# EAGLE design AstroHub (EAGLE 7.2.0)
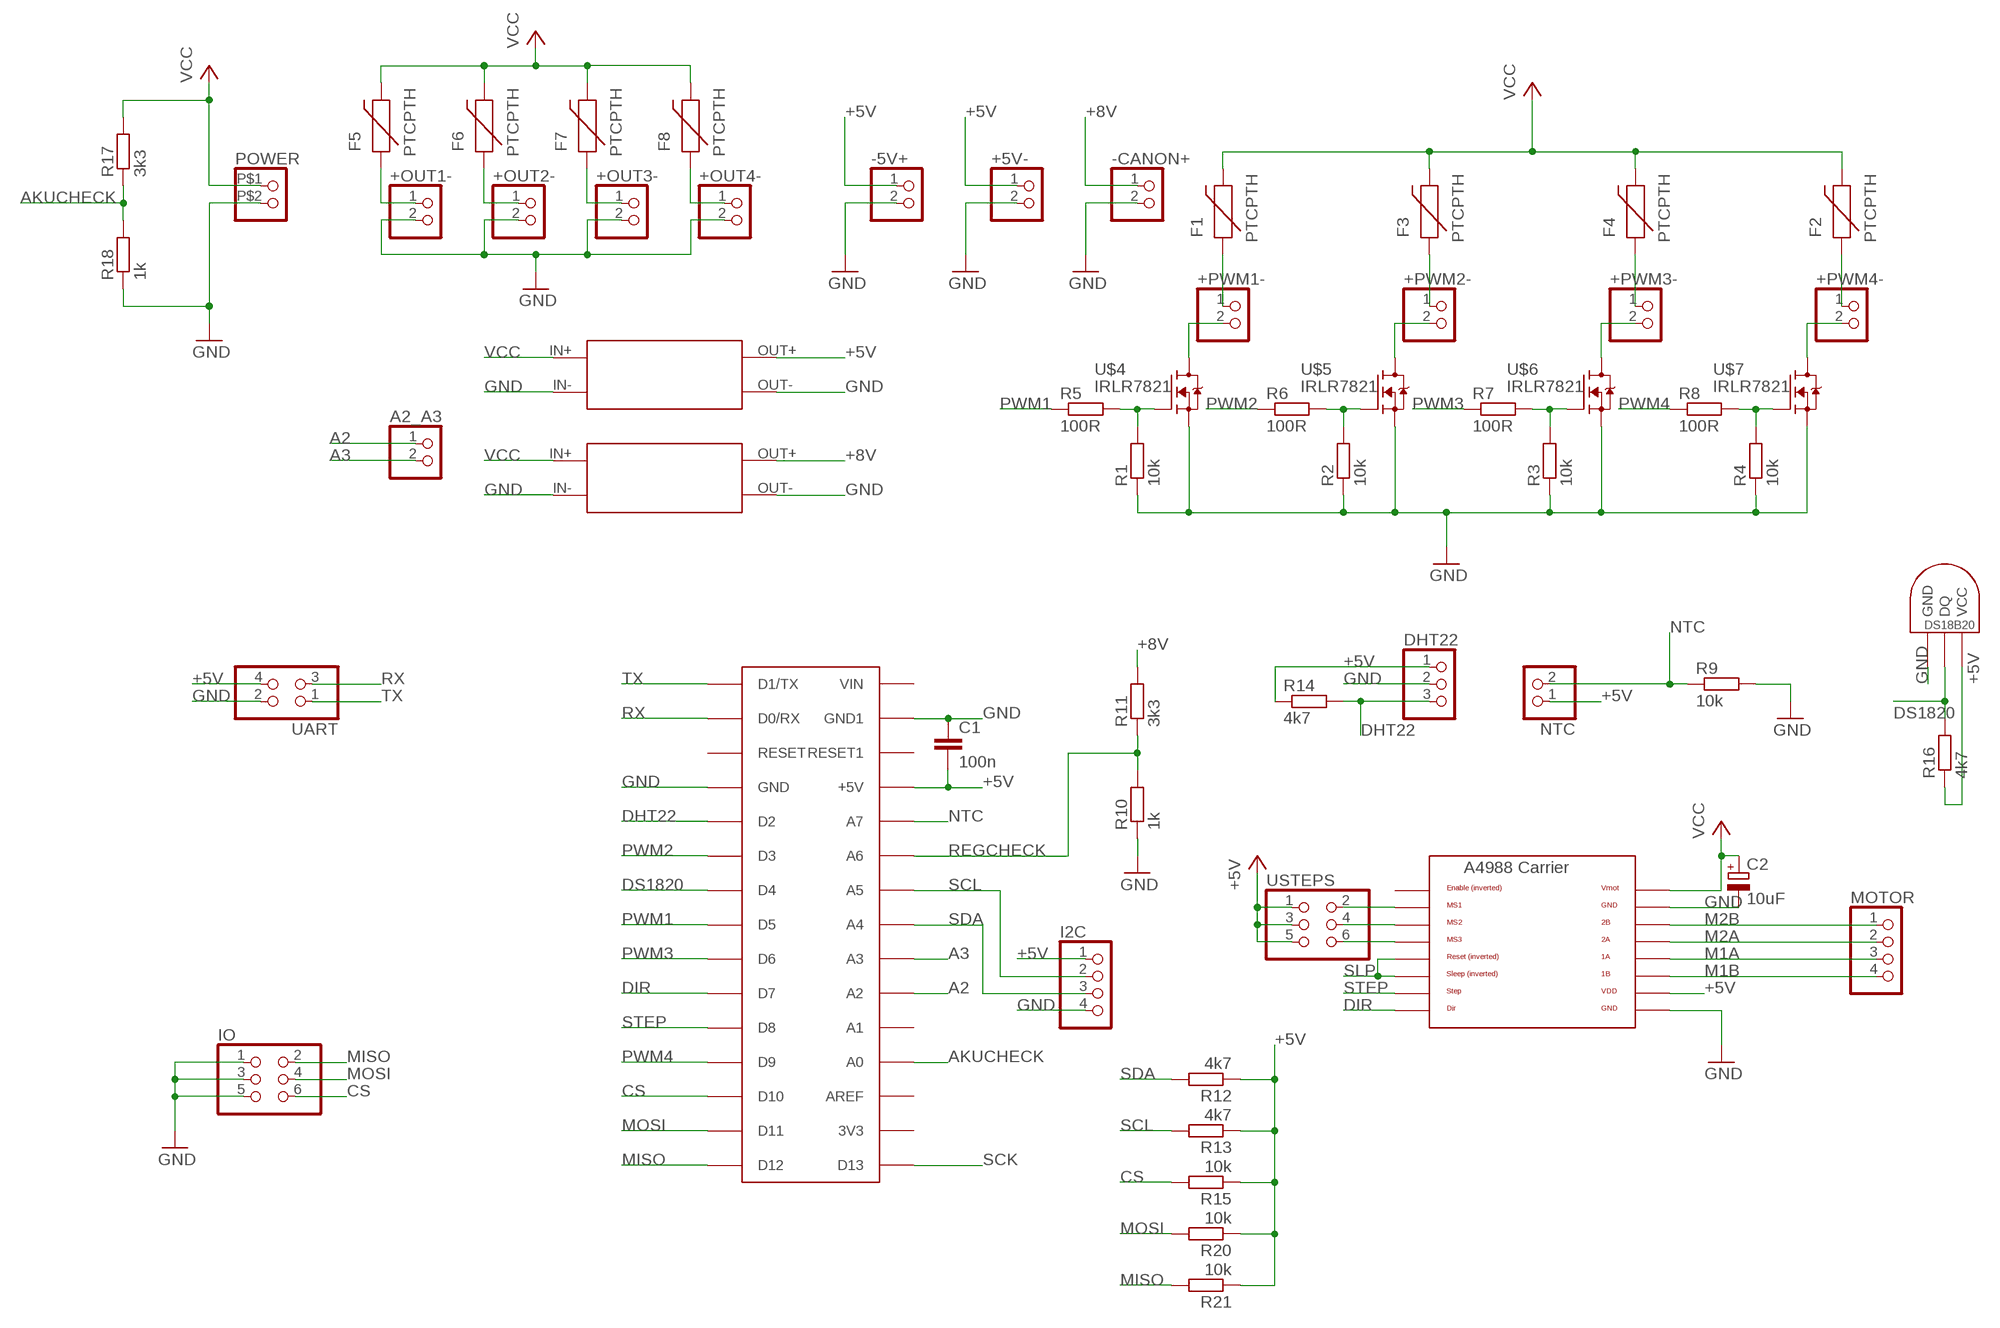
[diagram p0: schematic, sheet 1]

## Parts
+5V-  PINHD-1X2  [1X02]
+OUT1-  PINHD-1X2  [1X02]
+OUT2-  PINHD-1X2  [1X02]
+OUT3-  PINHD-1X2  [1X02]
+OUT4-  PINHD-1X2  [1X02]
+PWM1-  PINHD-1X2  [1X02]
+PWM2-  PINHD-1X2  [1X02]
+PWM3-  PINHD-1X2  [1X02]
+PWM4-  PINHD-1X2  [1X02]
-5V+  PINHD-1X2  [1X02]
-CANON+  PINHD-1X2  [1X02]
A2_A3  PINHD-1X2  [1X02]
C1  100n  C-EUC0603  [C0603]
C2  10uF  CPOL-EUSMCD  [SMC_D]
DHT22  PINHD-1X3  [1X03]
F1  PTCPTH  [PTC]
F2  PTCPTH  [PTC]
F3  PTCPTH  [PTC]
F4  PTCPTH  [PTC]
F5  PTCPTH  [PTC]
F6  PTCPTH  [PTC]
F7  PTCPTH  [PTC]
F8  PTCPTH  [PTC]
I2C  PINHD-1X4  [1X04]
IO  PINHD-2X3  [2X03]
MOTOR  PINHD-1X4  [1X04]
NTC  PINHD-1X2  [1X02]
POWER  PINHD-1X2BIG  [1X02BIG]
R1  10k  R-EU_R0603  [R0603]
R2  10k  R-EU_R0603  [R0603]
R3  10k  R-EU_R0603  [R0603]
R4  10k  R-EU_R0603  [R0603]
R5  100R  R-EU_R0603  [R0603]
R6  100R  R-EU_R0603  [R0603]
R7  100R  R-EU_R0603  [R0603]
R8  100R  R-EU_R0603  [R0603]
R9  10k  R-EU_R0603  [R0603]
R10  1k  R-EU_R0603  [R0603]
R11  3k3  R-EU_R0603  [R0603]
R12  4k7  R-EU_R0603  [R0603]
R13  4k7  R-EU_R0603  [R0603]
R14  4k7  R-EU_R0603  [R0603]
R15  10k  R-EU_R0603  [R0603]
R16  4k7  R-EU_R0603  [R0603]
R17  3k3  R-EU_R0603  [R0603]
R18  1k  R-EU_R0603  [R0603]
R20  10k  R-EU_R0603  [R0603]
R21  10k  R-EU_R0603  [R0603]
U$1  ARDUINONANO  [PDIP-32]
U$2  LM2596BOARD  [LM2596BOARD]
U$3  A4988BREAKOUT  [A4988BREAKOUT]
U$4  IRLR7821  [TO252]
U$5  IRLR7821  [TO252]
U$6  IRLR7821  [TO252]
U$7  IRLR7821  [TO252]
U$8  LM2596BOARD  [LM2596BOARD]
U$9  DS1820TO92  [DS1820]
UART  PINHD-2X2  [2X02]
USTEPS  PINHD-2X3  [2X03]

## Nets
+5V: +5V-.1 -5V+.1 C1.2 DHT22.1 I2C.1 NTC.1 R12.1 R13.1 R14.1 R15.1 R16.1 R20.1 R21.1 U$1.+5V U$2.OUT+ U$3.VDD U$9.VDD(VCC) UART.4 USTEPS.1 USTEPS.3 USTEPS.5
+8V: -CANON+.1 R11.2 U$8.OUT+
A2: A2_A3.1 U$1.A2
A3: A2_A3.2 U$1.A3
AKUCHECK: R17.1 R18.2 U$1.A0
CS: IO.6 R15.2 U$1.D10
DHT22: DHT22.3 R14.2 U$1.D2
DIR: U$1.D7 U$3.DIR
DS1820: R16.2 U$1.D4 U$9.DQ
GND: +5V-.2 +OUT1-.2 +OUT2-.2 +OUT3-.2 +OUT4-.2 -5V+.2 -CANON+.2 C1.1 C2.- DHT22.2 I2C.4 IO.1 IO.3 IO.5 POWER.P$2 R1.1 R2.1 R3.1 R4.1 R9.2 R10.1 R18.1 U$1.GND U$1.GND1 U$2.IN- U$2.OUT- U$3.GND U$3.GND@0(GND) U$4.2(S) U$5.2(S) U$6.2(S) U$7.2(S) U$8.IN- U$8.OUT- U$9.GND UART.2
M1A [VCC]: MOTOR.3 U$3.1A
M1B [VCC]: MOTOR.4 U$3.1B
M2A [VCC]: MOTOR.2 U$3.2A
M2B [VCC]: MOTOR.1 U$3.2B
MISO: IO.2 R21.2 U$1.D12
MOSI: IO.4 R20.2 U$1.D11
N$1: R4.2 R8.2 U$7.1(G)
N$2: R3.2 R7.2 U$6.1(G)
N$3: R2.2 R6.2 U$5.1(G)
N$4: R1.2 R5.2 U$4.1(G)
N$5: U$3.MS3 USTEPS.6
N$6: U$3.MS2 USTEPS.4
N$7: U$3.MS1 USTEPS.2
N$9 [VCC]: +PWM1-.1 F1.P$1
N$10 [VCC]: +PWM4-.1 F2.P$1
N$11 [VCC]: +PWM2-.1 F3.P$1
N$12 [VCC]: +PWM3-.1 F4.P$1
N$14 [VCC]: +OUT1-.1 F5.P$1
N$15 [VCC]: +OUT2-.1 F6.P$1
N$16 [VCC]: +OUT3-.1 F7.P$1
N$17 [VCC]: +OUT4-.1 F8.P$1
NTC: NTC.2 R9.1 U$1.A7
P1V [PWM]: +PWM1-.2 U$4.3(D)
P2V [PWM]: +PWM2-.2 U$5.3(D)
P3V [PWM]: +PWM3-.2 U$6.3(D)
P4V [PWM]: +PWM4-.2 U$7.3(D)
PWM1: R5.1 U$1.D5
PWM2: R6.1 U$1.D3
PWM3: R7.1 U$1.D6
PWM4: R8.1 U$1.D9
REGCHECK: R10.2 R11.1 U$1.A6
RX: U$1.D0/RX UART.3
SCK: U$1.D13
SCL: I2C.2 R13.2 U$1.A5
SDA: I2C.3 R12.2 U$1.A4
SLP: U$3.RST U$3.SLP(SLEEP)
STEP: U$1.D8 U$3.STEP
TX: U$1.D1/TX UART.1
VCC [VCC]: C2.+ F1.P$2 F2.P$2 F3.P$2 F4.P$2 F5.P$2 F6.P$2 F7.P$2 F8.P$2 POWER.P$1 R17.2 U$2.IN+ U$3.VMOT U$8.IN+
Unconnected: U$1.3V3 U$1.A1 U$1.AREF U$1.RESET U$1.RESET1 U$1.VIN U$3.EN

## Library data of the parts
+5V- +OUT1- +OUT2- +OUT3- +OUT4- +PWM1- +PWM2- +PWM3- +PWM4- -5V+ -CANON+ A2_A3 NTC POWER = pinhead:PINHD-1X2: PIN HEADER
C1 = resistor:C-EU: CAPACITOR, European symbol
C2 = resistor:CPOL-EU: POLARIZED CAPACITOR, European symbol
DHT22 = pinhead:PINHD-1X3: PIN HEADER
F1-F8 = SparkFun-PowerIC:PTC: Resettable Fuse PTC Resettable Fuse. Spark Fun Electronics SKU : COM-08357
I2C MOTOR = pinhead:PINHD-1X4: PIN HEADER
IO USTEPS = pinhead:PINHD-2X3: PIN HEADER
R1-R18 R20 R21 = resistor:R-EU_: RESISTOR, European symbol
U$1 = jet-lib:ARDUINONANO
U$2 U$8 = dc-dc-converter:LM2596BOARD
U$3 = reprap2:A4988BREAKOUT
U$4-U$7 = transistor-fet:IRLR7821
U$9 = Ava:DS1820: DS18B20 Programmable Resolution 1-Wire Digital Thermometer Description The DS18B20 digital thermometer provides 9-bit to 12-bit Celsius temperature measurements and has an alarm function with nonvolatile user-programmable upper and lower trigger points. The DS18B20 communicates over a 1-Wire® bus that by definition requires only one data line (and ground) for communication with a central microprocessor. It has an operating temperature range of -55°C to +125°C and is accurate to ±0.5°C over the range of -10°C to +85°C. In addition, the DS18B20 can derive power directly from the data line ("parasite power"), eliminating the need for an external power supply. Each DS18B20 has a unique 64-bit serial code, which allows multiple DS18B20s to function on the same 1-Wire bus. Thus, it is simple to use one microprocessor to control many DS18B20s distributed over a large area. Applications that can benefit from this feature include HVAC environmental controls, temperature monitoring systems inside buildings, equipment, or machinery, and process monitoring and control systems.
UART = pinhead:PINHD-2X2: PIN HEADER

## Net classes
0 rest: clearance 0.203 mm
1 VCC: clearance 0.508 mm
2 PWM: clearance 0.508 mm

## Board
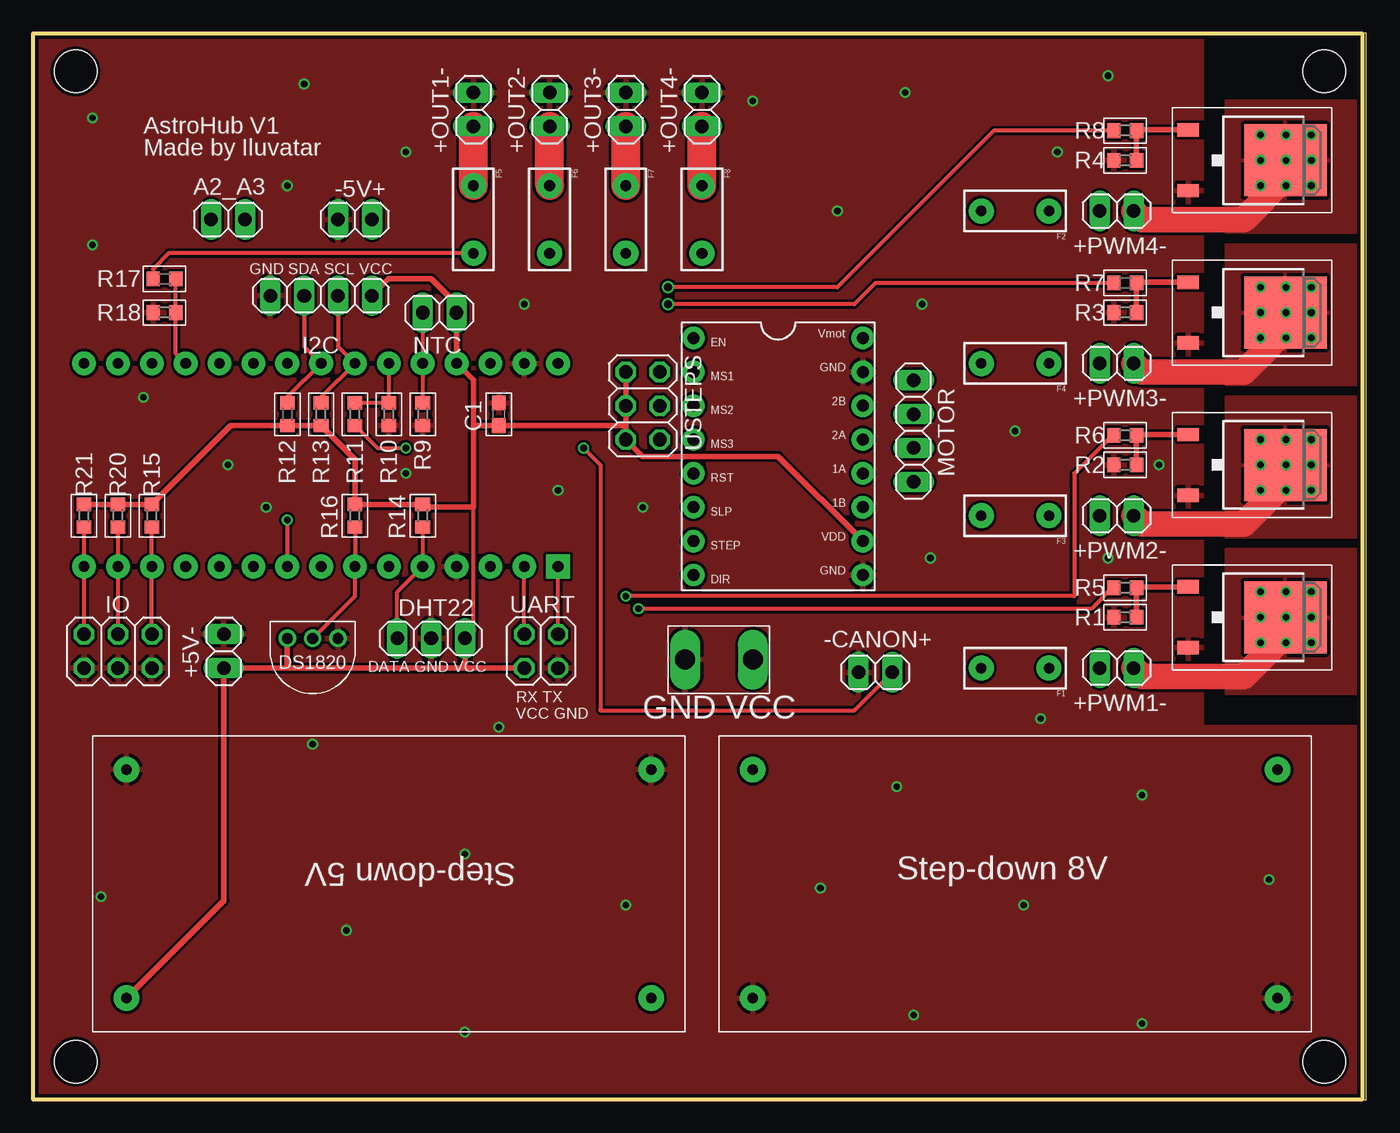
[diagram p1: board, top side]
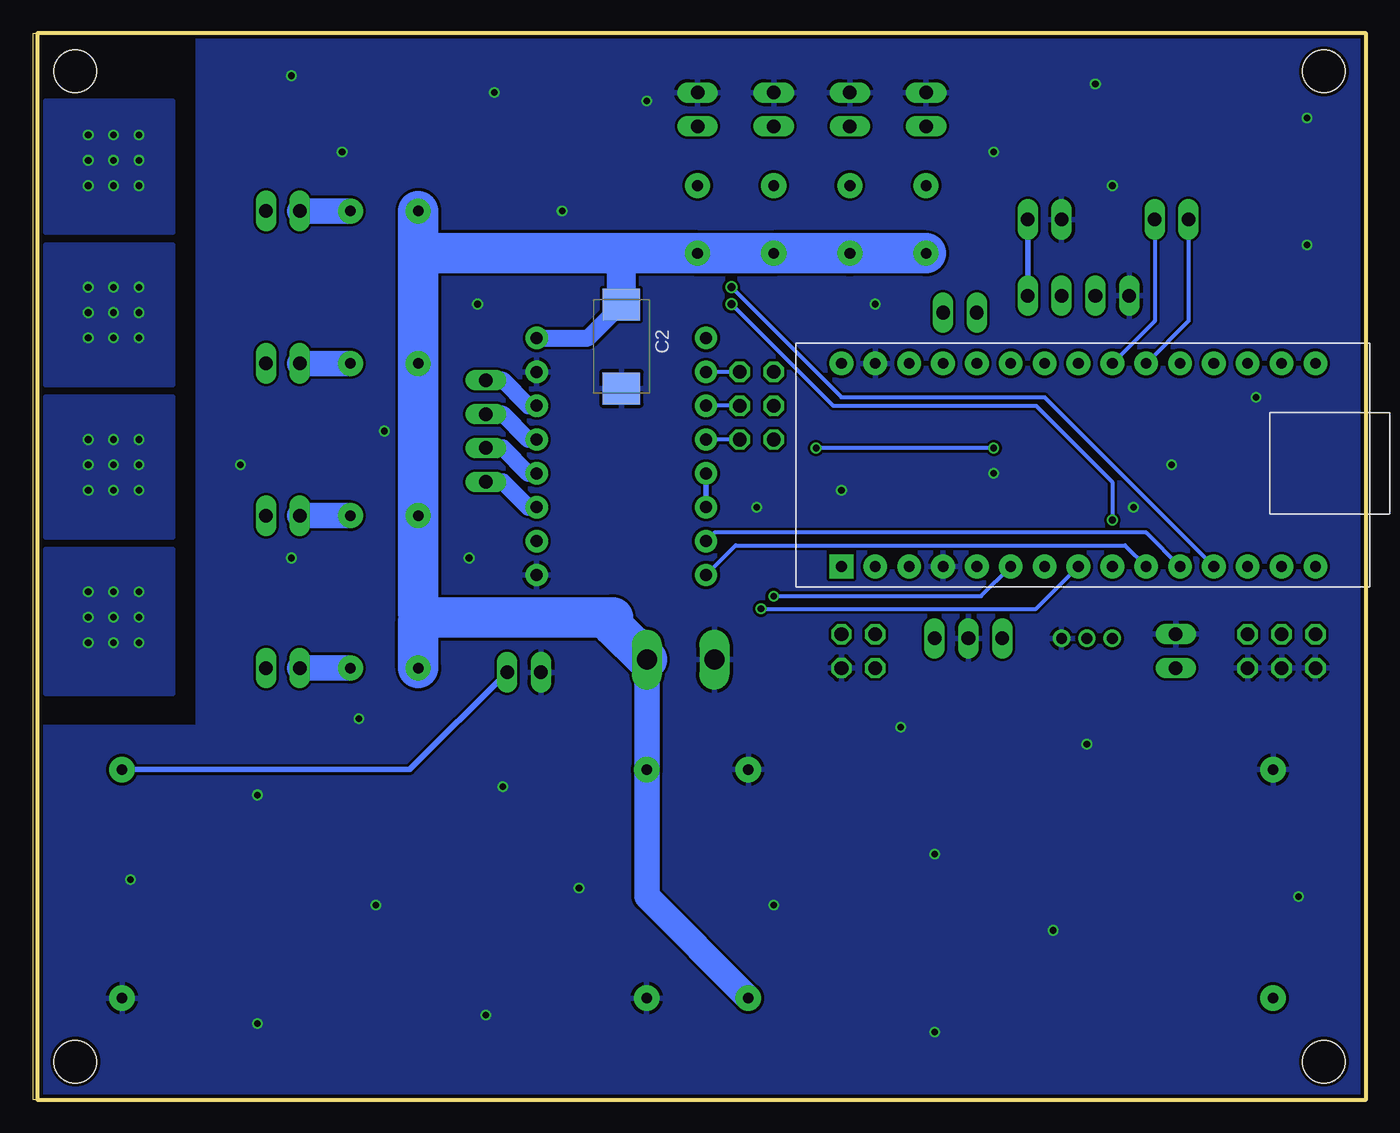
[diagram p2: board, bottom side, seen from below]

Size 100 x 80.01 mm. Coordinates in mm from the lower left corner, seen from the top.
Outline: 99.69,0 100,0 100,80 0,80 0,0
Outline: 99.69,0 99.69,80.01 0,80.01 0,0
Outline: 99.69,0 0,0
Copper layers (1*16): Top 0.035mm / dielectric 1.5mm / Bottom 0.035mm
Design rules "dirt_cheap_dirty_boards.v1": minimum track width 5mil, minimum drill 12mil, track to track 5mil, track to pad 5mil, pad to pad 5mil, via to via 5mil, smd to smd 0mil, copper to edge 10mil, drill to drill 10mil, minimum pad ring 10mil, minimum via ring 6mil, stop-mask expansion 2mil, vias tented up to drill 25mil, thermal gap 10mil
Holes 3.2 mm at 3.17,2.86 96.84,2.86 3.17,77.15 96.84,77.15

### Footprints (pad centres in the part's own frame; a part is rotated, then mirrored left to right if it is on the bottom)
1X02 = drill 1.016 long: 1 -1.27,0; 2 1.27,0
C0603 = smd 1.1 x 1: 1 -0.85,0; 2 0.85,0
SMC_D = smd 2.4 x 2.8: + -3.15,0; - 3.15,0
1X03 = drill 1.016 long: 1 -2.54,0; 2 0,0; 3 2.54,0
PTC = drill 0.8 pad 1.88: P$1 -2.54,0; P$2 2.54,0
1X04 = drill 1.016 long: 1 -3.81,0; 2 -1.27,0; 3 1.27,0; 4 3.81,0
2X03 = drill 1.016 octagon: 1 -2.54,-1.27; 2 -2.54,1.27; 3 0,-1.27; 4 0,1.27; 5 2.54,-1.27; 6 2.54,1.27
1X02BIG = drill 1.5 long: P$1 -2.54,0; P$2 2.54,0
R0603 = smd 1 x 1.1: 1 -0.85,0; 2 0.85,0
PDIP-32 = drill 0.8 pad 1.778: 3V3 15.24,-35.56; +5V 15.24,-10.16; A0 15.24,-30.48; A1 15.24,-27.94; A2 15.24,-25.4; A3 15.24,-22.86; A4 15.24,-20.32; A5 15.24,-17.78; A6 15.24,-15.24; A7 15.24,-12.7; AREF 15.24,-33.02; D0/RX 0,-5.08; D2 0,-12.7; D3 0,-15.24; D4 0,-17.78; D5 0,-20.32; D6 0,-22.86; D7 0,-25.4; D8 0,-27.94; D9 0,-30.48; D10 0,-33.02; D11 0,-35.56; D12 0,-38.1; D13 15.24,-38.1; GND 0,-10.16; GND1 15.24,-5.08; RESET 0,-7.62; RESET1 15.24,-7.62; VIN 15.24,-2.54 | drill 0.8 pad 1.778 square: D1/TX 0,-2.54
LM2596BOARD = drill 0.8 pad 1.93: IN+ -19.05,8.89; IN- -19.05,-8.255; OUT+ 20.32,8.89; OUT- 20.32,-8.255
A4988BREAKOUT = drill 0.9 pad 1.676: 1A 8.89,1.27; 1B 11.43,1.27; 2A 6.35,1.27; 2B 3.81,1.27; DIR 16.51,-11.43; EN -1.27,-11.43; GND 16.51,1.27; GND@0 1.27,1.27; MS1 1.27,-11.43; MS2 3.81,-11.43; MS3 6.35,-11.43; RST 8.89,-11.43; SLP 11.43,-11.43; STEP 13.97,-11.43; VDD 13.97,1.27; VMOT -1.27,1.27
TO252 = smd 1 x 1.6: 1 -2.28,-4.8; 2 2.28,-4.8 | smd 5.4 x 6.2: 3 0,2.5
DS1820 = drill 0.8: DQ 2.54,-1.27; GND 0.635,-1.27; VDD 4.445,-1.27
2X02 = drill 1.016 octagon: 1 -1.27,-1.27; 2 -1.27,1.27; 3 1.27,-1.27; 4 1.27,1.27

### Placement (x,y rotation side)
+5V-  14.29,33.66 90 top
+OUT1-  33.02,74.3 90 top
+OUT2-  38.73,74.3 90 top
+OUT3-  44.45,74.3 90 top
+OUT4-  50.16,74.3 90 top
+PWM1-  81.28,32.38 0 top
+PWM2-  81.28,43.81 0 top
+PWM3-  81.28,55.24 0 top
+PWM4-  81.28,66.67 0 top
-5V+  24.13,66.04 180 top
-CANON+  63.18,32.07 180 top
A2_A3  14.61,66.04 0 top
C1  34.92,51.44 270 top
C2  55.88,56.52 270 bottom
DHT22  29.84,34.61 180 top
F1  73.66,32.38 180 top
F2  73.66,66.67 180 top
F3  73.66,43.81 180 top
F4  73.66,55.24 180 top
F5  33.02,66.04 270 top
F6  38.73,66.04 270 top
F7  44.45,66.04 270 top
F8  50.16,66.04 270 top
I2C  21.59,60.33 180 top
IO  6.35,33.66 0 top
MOTOR  66.04,50.16 270 top
NTC  30.48,59.05 180 top
POWER  51.44,33.02 180 top
R1  81.92,36.2 0 top
R2  81.92,47.62 0 top
R3  81.92,59.05 0 top
R4  81.92,70.48 0 top
R5  81.92,38.42 0 top
R6  81.92,49.85 0 top
R7  81.92,61.28 0 top
R8  81.92,72.71 0 top
R9  29.21,51.44 270 top
R10  26.67,51.44 90 top
R11  24.13,51.44 270 top
R12  19.05,51.44 90 top
R13  21.59,51.44 90 top
R14  29.21,43.81 270 top
R15  8.89,43.81 270 top
R16  24.13,43.81 270 top
R17  9.84,61.59 180 top
R18  9.84,59.05 0 top
R20  6.35,43.81 270 top
R21  3.81,43.81 270 top
U$1  41.91,40.01 90 bottom
U$2  27.3,16.51 180 top
U$3  60.96,55.88 270 top
U$4  91.44,36.2 270 top
U$5  91.44,47.62 270 top
U$6  91.44,59.05 270 top
U$7  91.44,70.48 270 top
U$8  73.03,15.88 0 top
U$9  23.5,33.34 180 top
UART  38.1,33.66 180 top
USTEPS  45.72,52.07 270 top

### Tracks (layer width: path | path; a pad name or v marks a point on that pad's centre or on a via)
+5V
  Top 0.305: 34.92,50.38 C1.2 34.51,50.16 | R14.1 29.43,44.45 | 33.02,35.24 33.02,44.45
  Top 0.406: U$2.OUT+ 14.29,14.92 +5V-.1 19.05,32.38 | 19.05,32.38 32.38,32.38 | 32.38,32.38 UART.4 | 32.38,32.38 DHT22.1 33.02,35.24 | U$9.VDD 19.05,32.38 | 33.02,50.59 33.02,44.45 29.21,44.45 R14.1 R16.1 24.13,48.05 R13.1 R12.1 14.81,50.59 R15.1 R20.1 R21.1 | 33.02,50.59 33.02,53.98 U$1.+5V NTC.1 31.75,59.69 29.84,61.59 26.67,61.59 I2C.1 | USTEPS.1 USTEPS.3 44.45,50.59 | U$3.VDD 55.88,48.26 45.72,48.26 USTEPS.5 44.45,50.59 | 44.45,50.59 C1.2 33.02,50.59
  Bottom 0.406: -5V+.1 I2C.1
+8V  (via drill 0.5)
  Top 0.305: R11.2 25.82,48.9 v27.94,48.9 | v41.27,48.9 42.55,47.62 42.55,29.21 61.59,29.21 -CANON+.1
  Bottom 0.305: v27.94,48.9 v41.27,48.9
  Bottom 0.406: U$8.OUT+ 71.75,24.77 -CANON+.1
A2
  Bottom 0.305: A2_A3.1 13.34,58.42 U$1.A2
A3
  Bottom 0.305: A2_A3.2 15.88,58.42 U$1.A3
AKUCHECK
  Top 0.305: R17.1 R18.2 10.69,55.98 U$1.A0
CS
  Top 0.305: IO.6 U$1.D10 R15.2
DHT22
  Top 0.305: DHT22.3 27.3,38.1 U$1.D2 R14.2
DIR
  Bottom 0.305: U$3.DIR 47.31,41.59 18.1,41.59 U$1.D7
DS1820
  Top 0.305: R16.2 U$1.D4 24.13,37.78 U$9.DQ
GND  (via drill 0.5)
  other vias: 27.94,46.99 8.26,52.7 14.61,47.62 17.46,44.45 20.95,26.67 5.08,15.24 23.5,12.7 32.38,18.41 32.38,5.08 34.92,27.94 44.45,14.61 59.05,15.88 64.77,23.5 66.04,6.35 83.19,5.71 74.3,14.61 83.19,22.86 92.71,16.51 67.31,40.64 73.66,50.16 45.72,44.45 66.67,59.69 60.33,66.67 76.83,71.12 65.41,75.56 53.98,74.93 39.37,45.72 36.83,59.69 19.05,68.58 4.45,73.66 20.32,76.2 27.94,71.12 4.45,64.14 75.56,28.57 84.45,47.62 80.64,40.64 80.64,76.83
  pour Top: 87.63,80.01 87.63,27.94 99.69,27.94 99.69,0 0,0 0,80.01
  pour Bottom: 0,80.01 87.63,80.01 87.63,27.94 99.69,27.94 99.69,0 0,0
M1A
  Bottom 1.27: U$3.1A 62.87,46.99 64.77,48.9 MOTOR.3
M1B
  Bottom 1.27: U$3.1B 62.87,44.45 64.77,46.35 MOTOR.4
M2A
  Bottom 1.27: U$3.2A 62.87,49.53 64.77,51.44 MOTOR.2
M2B
  Bottom 1.27: U$3.2B 62.87,52.07 64.77,53.98 MOTOR.1
MISO
  Top 0.305: IO.2 U$1.D12 R21.2
MOSI
  Top 0.305: IO.4 U$1.D11 R20.2
N$1
  Top 0.406: U$7.1 82.82,72.77 R8.2 R4.2
N$2
  Top 0.406: U$6.1 82.82,61.34 R7.2 R3.2
N$3
  Top 0.406: R2.2 R6.2 82.82,49.91 U$5.1
N$4
  Top 0.406: U$4.1 82.82,38.48 R5.2 R1.2
N$5
  Bottom 0.305: USTEPS.6 U$3.MS3
N$6
  Bottom 0.305: USTEPS.4 U$3.MS2
N$7
  Bottom 0.305: USTEPS.2 U$3.MS1
N$9
  Bottom 1.93: F1.P$1 +PWM1-.1
N$10
  Bottom 1.93: F2.P$1 +PWM4-.1
N$11
  Bottom 1.93: F3.P$1 +PWM2-.1
N$12
  Bottom 1.93: F4.P$1 +PWM3-.1
N$14
  Top 2.184: F5.P$1 +OUT1-.1
N$15
  Top 2.184: F6.P$1 +OUT2-.1
N$16
  Top 2.184: F7.P$1 +OUT3-.1
N$17
  Top 2.184: F8.P$1 +OUT4-.1
NTC
  Top 0.305: NTC.2 U$1.A7 R9.1
P1V  (via drill 0.5)
  Top 1.93: +PWM1-.2 83.19,31.75 90.81,31.75 93.94,34.88 U$4.3
  other vias: 92.08,38.1 92.08,36.2 92.08,34.29 93.98,34.29 93.98,36.2 93.98,38.1 95.89,38.1 95.89,36.2 95.89,34.29
  pour Top: 99.06,30.48 89.53,30.48 89.53,41.27 99.69,41.27 99.69,30.48
  pour Bottom: 89.53,41.27 89.53,30.48 99.06,30.48 99.06,41.27
P2V  (via drill 0.5)
  Top 1.93: +PWM2-.2 83.19,43.18 90.81,43.18 93.34,45.72 93.34,48.9 93.94,48.3 U$5.3
  other vias: 92.08,49.53 92.08,47.62 92.08,45.72 93.98,45.72 93.98,47.62 93.98,49.53 95.89,49.53 95.89,47.62 95.89,45.72
  pour Top: 99.69,42.23 89.53,42.23 89.53,52.7 99.69,52.7
  pour Bottom: 89.53,52.7 89.53,42.23 99.06,42.23 99.06,52.7
P3V  (via drill 0.5)
  Top 1.93: +PWM3-.2 83.19,54.61 90.81,54.61 93.94,57.74 U$6.3
  other vias: 92.08,60.96 92.08,59.05 92.08,57.15 93.98,57.15 95.89,57.15 95.89,59.05 95.89,60.96 93.98,60.96 93.98,59.05
  pour Top: 99.69,53.66 89.53,53.66 89.53,64.14 99.69,64.14
  pour Bottom: 89.53,64.14 89.53,53.66 99.06,53.66 99.06,64.14
P4V  (via drill 0.5)
  Top 1.93: +PWM4-.2 83.19,66.04 90.81,66.04 93.94,69.17 U$7.3
  other vias: 92.08,72.39 92.08,70.48 92.08,68.58 95.89,68.58 93.98,68.58 93.98,70.48 93.98,72.39 95.89,72.39 95.89,70.48
  pour Top: 99.69,65.09 89.53,65.09 89.53,74.93 99.69,74.93
  pour Bottom: 89.53,74.93 89.53,65.09 99.06,65.09 99.06,74.93
PWM1  (via drill 0.5)
  Top 0.305: R5.1 80.96,38.42 79.38,36.83 v45.4,36.83
  Bottom 0.305: v45.4,36.83 24.77,36.83 U$1.D5
PWM2  (via drill 0.5)
  Top 0.305: 80.96,49.85 78.11,46.99 78.11,37.78 v44.45,37.78
  Top 0.406: 80.96,49.85 R6.1
  Bottom 0.305: v44.45,37.78 28.89,37.78 U$1.D3
PWM3  (via drill 0.5, 0.6)
  Top 0.305: R7.1 63.18,61.28 61.59,59.69 v47.62,59.69 | v19.05,43.5 U$1.D6
  Bottom 0.305: v47.62,59.69 40.01,52.07 24.77,52.07 19.05,46.35 v19.05,43.5
PWM4  (via drill 0.6)
  Top 0.305: R8.1 72.07,72.71 60.33,60.96 v47.62,60.96
  Bottom 0.305: U$1.D9 24.13,52.7 39.37,52.7 v47.62,60.96
REGCHECK
  Top 0.305: R11.1 R10.2 U$1.A6
RX
  Top 0.305: UART.3 U$1.D0/RX
SCL
  Top 0.305: I2C.2 22.86,56.52 U$1.A5 21.59,52.7 R13.2
SDA
  Top 0.305: I2C.3 20.32,56.52 U$1.A4 19.05,52.7 R12.2
SLP
  Bottom 0.406: U$3.RST 49.53,45.09 U$3.SLP
STEP
  Bottom 0.305: U$1.D8 16.51,42.55 48.9,42.55 U$3.STEP
TX
  Top 0.305: UART.1 U$1.D1/TX
VCC
  Top 0.305: F5.P$2 10.16,63.5 8.99,62.33 R17.2
  Bottom 1.27: U$3.VMOT 58.4,57.15 C2.+
  Bottom 1.93: POWER.P$1 U$8.IN+ 53.98,15.24 U$2.IN+
  Bottom 2.184: C2.+ 55.88,63.5
  Bottom 3.048: POWER.P$1 56.52,35.56 56.52,36.2 70.8,36.2 | F5.P$2 F6.P$2 F7.P$2 F8.P$2 55.88,63.5 71.12,63.5 | F2.P$2 71.12,63.5 | 71.12,63.5 F4.P$2 F3.P$2 71.12,36.51 70.8,36.2 | F1.P$2 71.12,35.88 70.8,36.2

### Text on the board
tNames: AstroHub V1 / Made by Iluvatar | GND SDA SCL VCC | DATA GND VCC | RX TX / VCC GND | GND VCC | Step-down 5V | Step-down 8V